# EAGLE design Rotary Encoder Breakout (EAGLE 9.6.2)
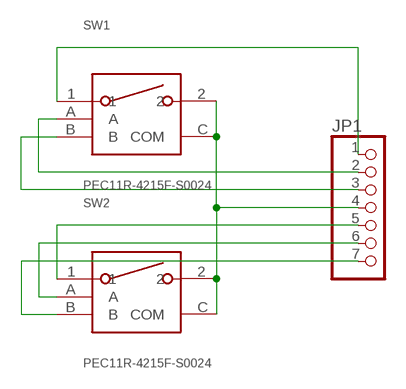
[diagram p0: schematic, sheet 1]

## Parts
JP1  PINHD-1X07_2.54-90°  [1X07/90]
SW1  PEC11R-4215F-S0024  [PEC11R-4215F-S0024]
SW2  PEC11R-4215F-S0024  [PEC11R-4215F-S0024]

## Nets
N$1: JP1.4 SW1.2 SW1.C(COM) SW2.2 SW2.C(COM)
N$2: JP1.5 SW2.1
N$3: JP1.6 SW2.A
N$4: JP1.7 SW2.B
N$5: JP1.1 SW1.1
N$6: JP1.2 SW1.A
N$7: JP1.3 SW1.B

## Library data of the parts
JP1 = pinhead-2:PINHD-1X07: PIN HEADER
SW1 SW2 = Switch:PEC11R-4215F-S0024: ROTARY ENCODER MECHANICAL 24PPR Manufacturer's datasheet <https://www.bourns.com/docs/Product-Datasheets/PEC11R.pdf>; CREATED_BY: PCBLayout.com; DIGIKEY_PART_NUMBER: PEC11R-4215F-S0024-ND; MANUFACTURER: Bourns Inc.; MPN: PEC11R-4215F-S0024

## Board
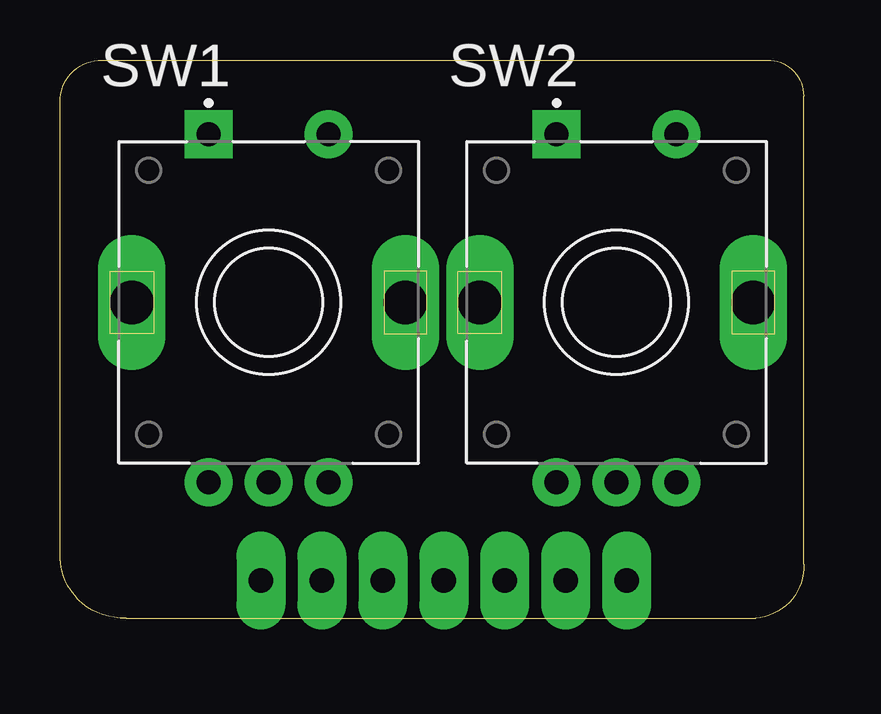
[diagram p1: board, top side]
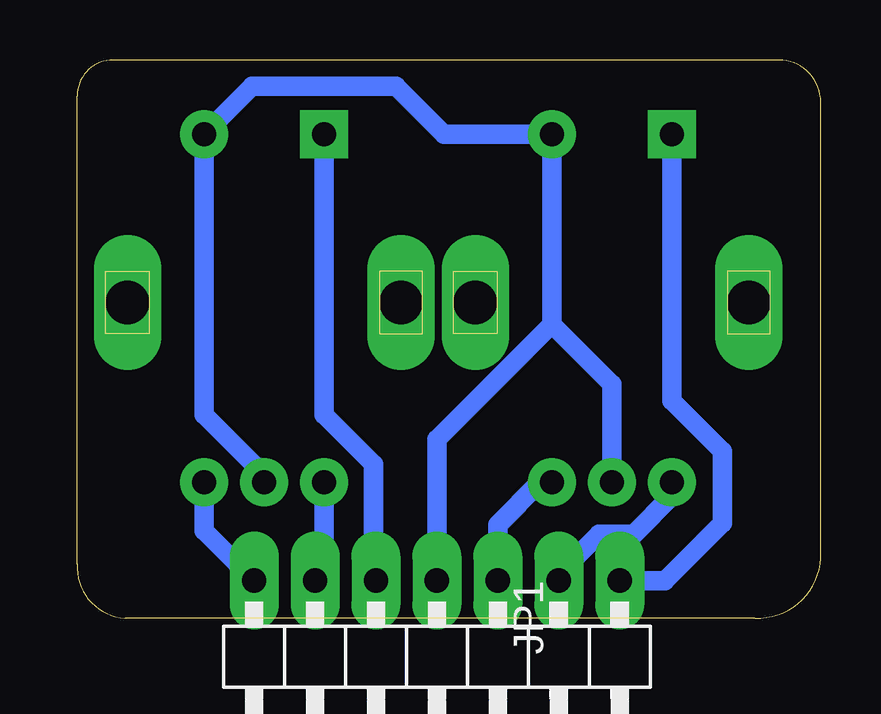
[diagram p2: board, bottom side, seen from below]

Size 31 x 23.25 mm. Coordinates in mm from the lower left corner, seen from the top.
Outline: 2.75,0 29,0 arc90 31,2.25 31,21.75 arc90 29.5,23.25 1.75,23.25 arc90 0,21.5 0,2.5 arc90 2.75,0
Copper layers (1*16): Top 0.035mm / dielectric 1.5mm / Bottom 0.035mm
Design rules "swidzi_milling_3018_tht_test": minimum track width 20mil, minimum drill 0.8mm, track to track 20mil, track to pad 20mil, pad to pad 20mil, via to via 6mil, smd to smd 6mil, copper to edge 15mil, drill to drill 6mil, minimum pad ring 10mil, minimum via ring 8mil, stop-mask expansion 4mil, vias tented up to drill 0mil, thermal gap 10mil

### Footprints (pad centres in the part's own frame; a part is rotated, then mirrored left to right if it is on the bottom)
1X07/90 = drill 1.016 long: 1 -7.62,-3.81; 2 -5.08,-3.81; 3 -2.54,-3.81; 4 0,-3.81; 5 2.54,-3.81; 6 5.08,-3.81; 7 7.62,-3.81
PEC11R-4215F-S0024 = drill 1 square: 1 -2.5,7 | drill 1: 2 2.5,7; A -2.5,-7.5; B 2.5,-7.5; C 0,-7.5 | drill 1.8 long: P1 -5.7,0; P2 5.7,0

### Placement (x,y rotation side)
JP1  16,-2.25 180 bottom
SW1  8.7,13.15 0 top
SW2  23.2,13.15 0 top

### Tracks (layer width: path | path; a pad name or v marks a point on that pad's centre or on a via)
N$1
  Bottom 0.813: 11.2,12.25 SW1.2 15.7,20.15 17.7,22.15 23.7,22.15 SW2.2 25.7,8.47 23.2,5.97 SW2.C | SW1.C 8.7,9.75 11.2,12.25 | 11.2,12.25 16,7.45 JP1.4
N$2
  Bottom 0.813: SW2.1 20.7,8.47 18.64,6.4 18.64,1.66 JP1.5
N$3
  Bottom 0.813: SW2.A 20.7,1.94 JP1.6
N$4
  Bottom 0.813: SW2.B 25.7,3.64 JP1.7
N$5
  Bottom 0.813: SW1.1 6.2,9.05 4.1,6.95 4.1,3.95 6.49,1.56 JP1.1
N$6
  Bottom 0.813: JP1.2 10.92,1.83 9.25,3.5 7.78,3.5 6.2,5.08 SW1.A
N$7
  Bottom 0.813: SW1.B 11.7,5.65 13.46,3.89 JP1.3